# EAGLE design WaterThePlants168 (EAGLE 7.2.0)
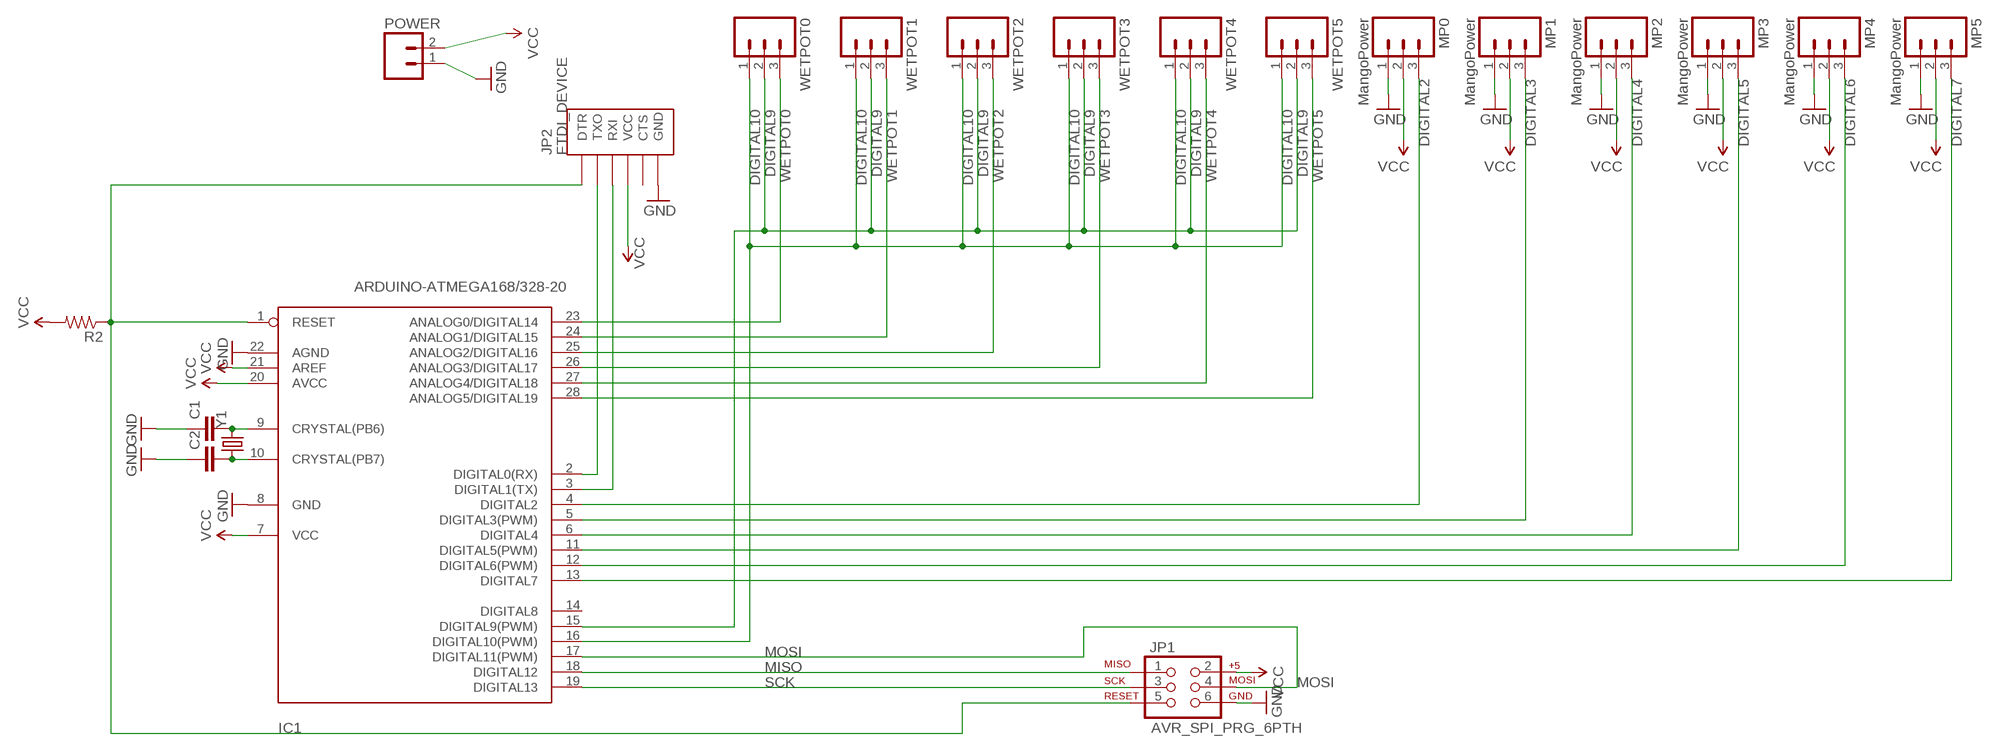
[diagram p0: schematic, sheet 1]

## Parts
C1  CAPPTH2  [CAP-PTH-SMALL2]
C2  CAPPTH2  [CAP-PTH-SMALL2]
IC1  ARDUINO-ATMEGA168/328-20  [DIL28-3]
JP1  AVR_SPI_PRG_6PTH  [2X3]
JP2  FTDI_DEVICE  [FTDI_DEVICE_SIDE]
MP0  MangoPower  M03PTH  [1X03]
MP1  MangoPower  M03PTH  [1X03]
MP2  MangoPower  M03PTH  [1X03]
MP3  MangoPower  M03PTH  [1X03]
MP4  MangoPower  M03PTH  [1X03]
MP5  MangoPower  M03PTH  [1X03]
POWER  M02POLAR  [MOLEX-1X2]
R2  RESISTORAXIAL-0.3  [AXIAL-0.3]
WETPOT0  M03PTH  [1X03]
WETPOT1  M03PTH  [1X03]
WETPOT2  M03PTH  [1X03]
WETPOT3  M03PTH  [1X03]
WETPOT4  M03PTH  [1X03]
WETPOT5  M03PTH  [1X03]
Y1  CRYSTALHC49US  [HC49US]

## Nets
DIGITAL2: IC1.4(DIGITAL2) MP0.3
DIGITAL3: IC1.5(DIGITAL3(PWM)) MP1.3
DIGITAL4: IC1.6(DIGITAL4) MP2.3
DIGITAL5: IC1.11(DIGITAL5(PWM)) MP3.3
DIGITAL6: IC1.12(DIGITAL6(PWM)) MP4.3
DIGITAL7: IC1.13(DIGITAL7) MP5.3
DIGITAL9: IC1.15(DIGITAL9(PWM)) WETPOT0.2 WETPOT1.2 WETPOT2.2 WETPOT3.2 WETPOT4.2 WETPOT5.2
DIGITAL10: IC1.16(DIGITAL10(PWM)) WETPOT0.1 WETPOT1.1 WETPOT2.1 WETPOT3.1 WETPOT4.1 WETPOT5.1
GND: C1.1 C2.1 IC1.8(GND) IC1.22(AGND) JP1.6 JP2.P$6(GND) MP0.1 MP1.1 MP2.1 MP3.1 MP4.1 MP5.1 POWER.1
MISO: IC1.18(DIGITAL12) JP1.1
MOSI: IC1.17(DIGITAL11(PWM)) JP1.4
N$1: IC1.2(DIGITAL0(RX)) JP2.P$2(TXO)
N$2: IC1.3(DIGITAL1(TX)) JP2.P$3(RXI)
N$3: C1.2 IC1.9(CRYSTAL(PB6)) Y1.2
N$4: C2.2 IC1.10(CRYSTAL(PB7)) Y1.1
RESET: IC1.1(RESET) JP1.5 JP2.P$1(DTR) R2.P$1
SCK: IC1.19(DIGITAL13) JP1.3
VCC: IC1.7(VCC) IC1.20(AVCC) IC1.21(AREF) JP1.2 JP2.P$4(VCC) MP0.2 MP1.2 MP2.2 MP3.2 MP4.2 MP5.2 POWER.2 R2.P$2
WETPOT0: IC1.23(ANALOG0/DIGITAL14) WETPOT0.3
WETPOT1: IC1.24(ANALOG1/DIGITAL15) WETPOT1.3
WETPOT2: IC1.25(ANALOG2/DIGITAL16) WETPOT2.3
WETPOT3: IC1.26(ANALOG3/DIGITAL17) WETPOT3.3
WETPOT4: IC1.27(ANALOG4/DIGITAL18) WETPOT4.3
WETPOT5: IC1.28(ANALOG5/DIGITAL19) WETPOT5.3
Unconnected: IC1.14(DIGITAL8) JP2.P$5(CTS)

## Library data of the parts
C1 C2 = SparkFun-Capacitors:CAP: Capacitor Standard 0603 ceramic capacitor, and 0.1" leaded capacitor.
IC1 = Parnell-CustomParts:ARDUINO-ATMEGA168/328: ATMEGA168/328 with Arduino Pin Mapping
JP1 = SparkFun-Connectors:AVR_SPI_PRG_6: AVR ISP 6 Pin This is the reduced ISP connector for AVR programming. Common on Arduino. This footprint will take up less PCB space and can be used with a 10-pin to 6-pin adapter such as SKU: BOB-08508 **Special note about "TEST_POINT" package. The stop mask is on the top side, so if you want your programming test points to be on the bottom of your board, make sure to place this package on the bottom side of the board. This also ensure that the orientation to program from the bottom side will be correct.
JP2 = SparkFun-Connectors:FTDI_DEVICE: Connector which mates to FTDI basic or FTDI cable.
MP0 MP1-MP5 WETPOT0 WETPOT1-WETPOT5 = SparkFun-Connectors:M03: Header 3 Standard 3-pin 0.1" header. Use with straight break away headers (SKU : PRT-00116), right angle break away headers (PRT-00553), swiss pins (PRT-00743), machine pins (PRT-00117), and female headers (PRT-00115). Molex polarized connector foot print use with SKU : PRT-08232 with associated crimp pins and housings.
POWER = SparkFun-Connectors:M02: Standard 2-pin 0.1" header. Use with - straight break away headers ( PRT-00116) - right angle break away headers (PRT-00553) - swiss pins (PRT-00743) - machine pins (PRT-00117) - female headers (PRT-00115) Molex polarized connector foot print use with: PRT-08233 with associated crimp pins and housings. 2.54_SCREWTERM for use with PRT-10571. 3.5mm Screw Terminal footprints for PRT-08084 5mm Screw Terminal footprints for use with PRT-08432
R2 = SparkFun-Resistors:RESISTOR: Resistor Basic schematic elements and footprints for 0603, 1206, and PTH resistors.
Y1 = SparkFun-FreqCtrl:CRYSTAL: Various standard crystals. Proven footprints.

## Board
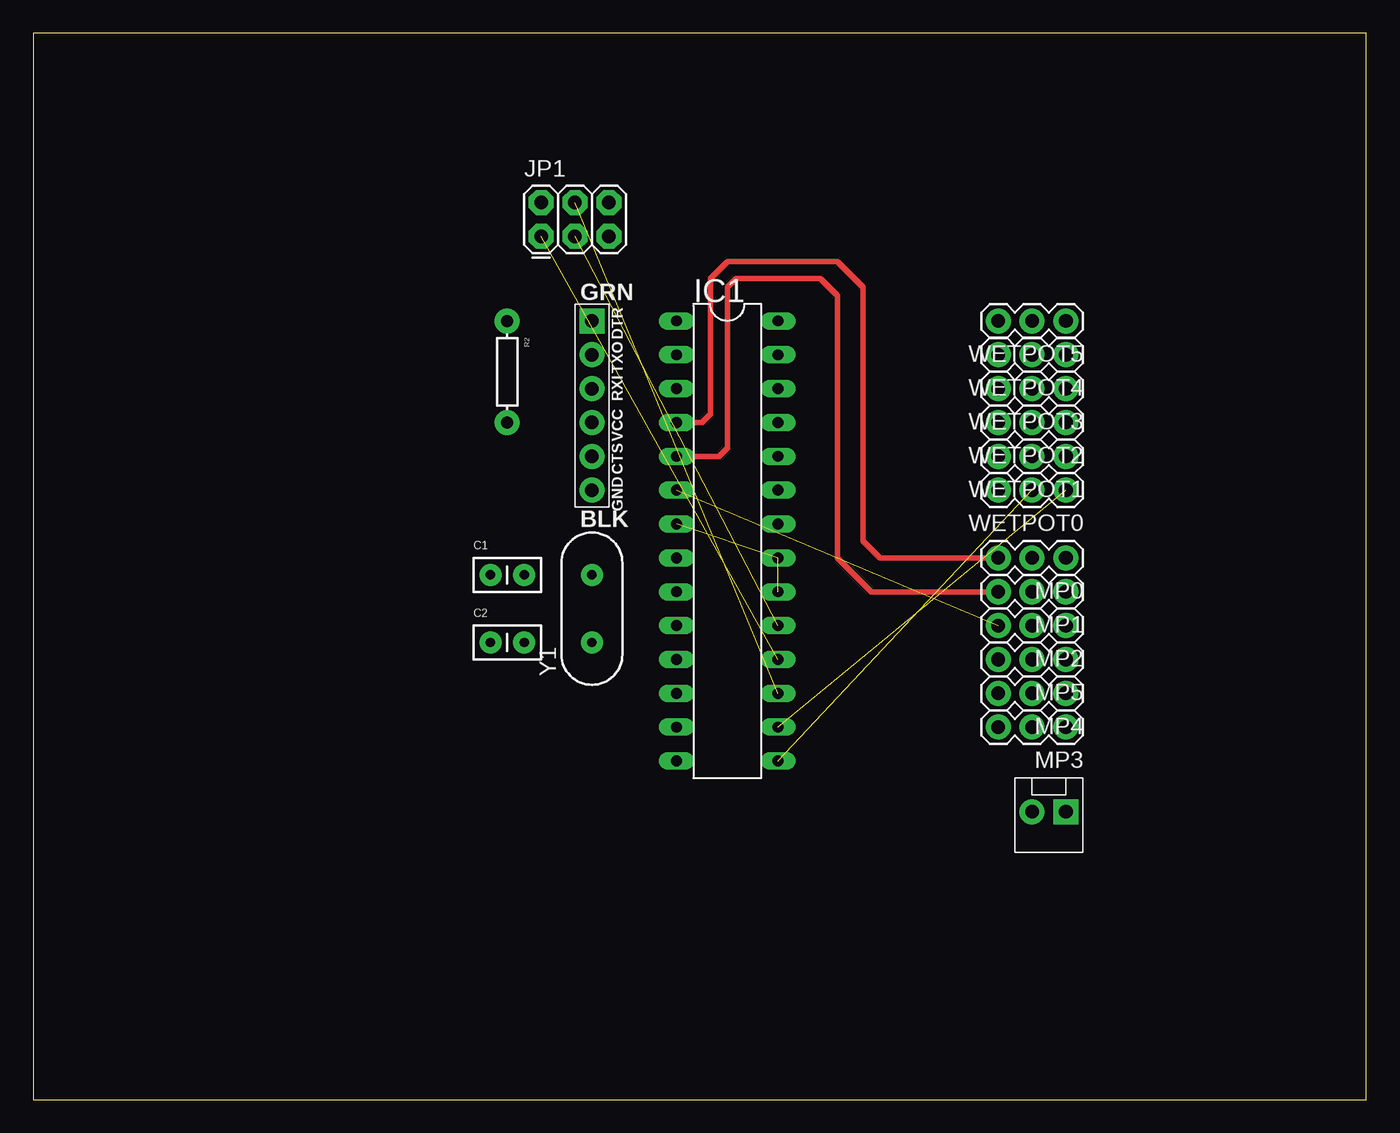
[diagram p1: board, top side]
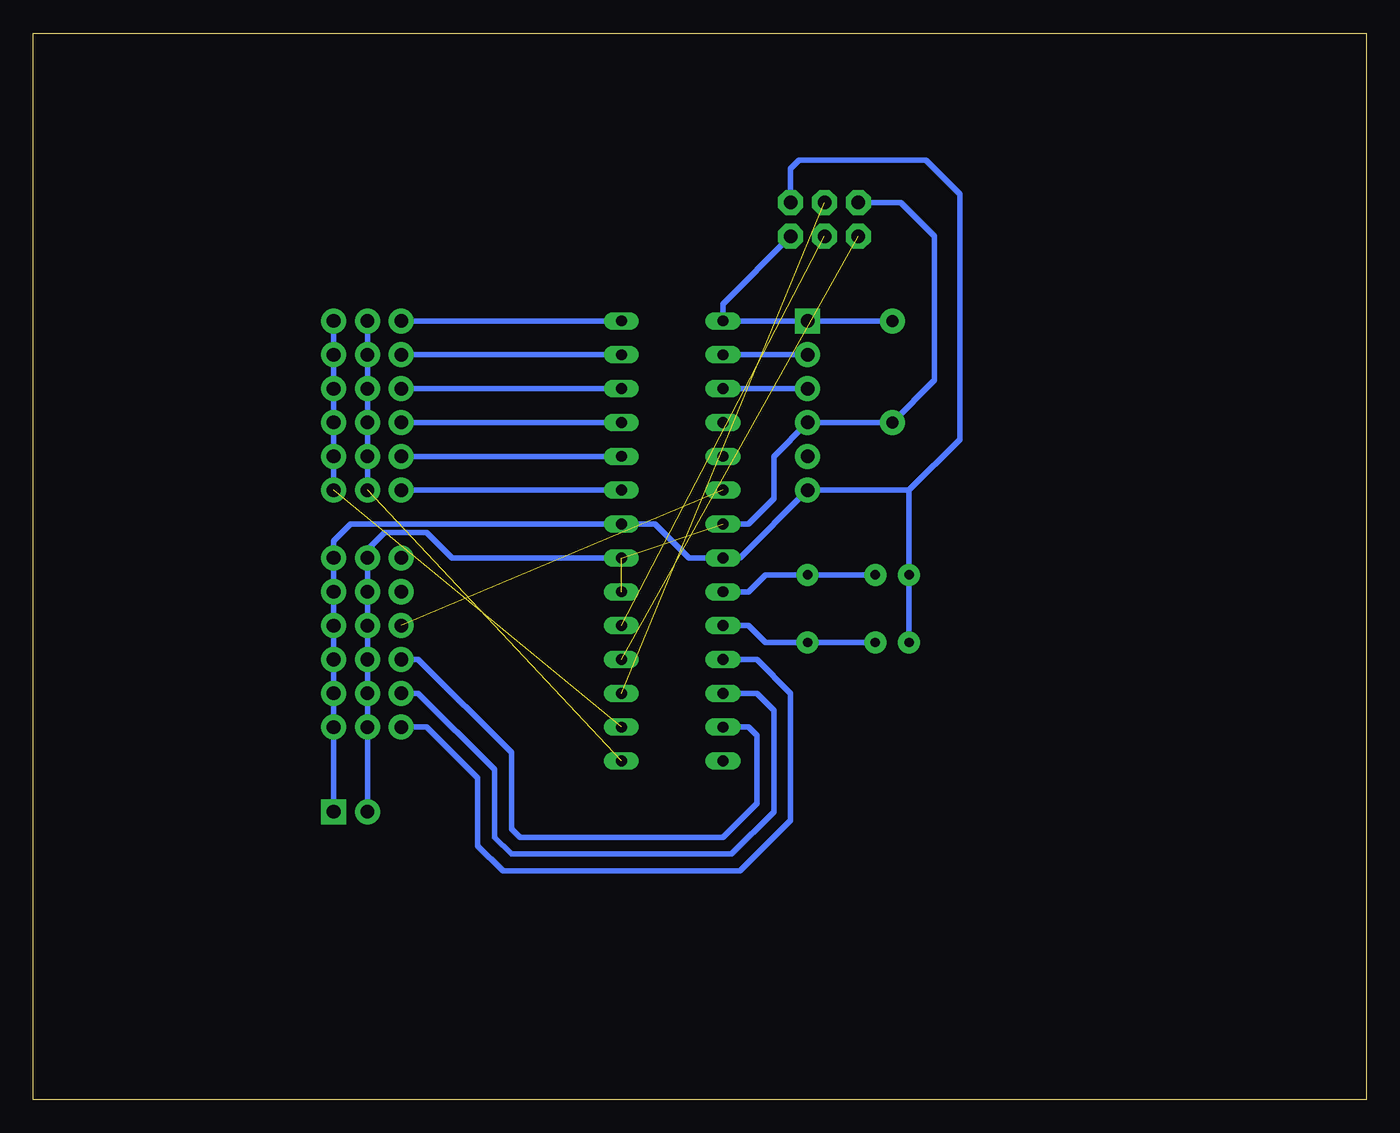
[diagram p2: board, bottom side, seen from below]

Size 100 x 80 mm. Coordinates in mm from the lower left corner, seen from the top.
Outline: 0,0 100,0 100,80 0,80 0,0
Copper layers (1*16): Top 0.035mm / dielectric 1.5mm / Bottom 0.035mm
Design rules "default": minimum track width 10mil, minimum drill 24mil, track to track 8mil, track to pad 8mil, pad to pad 8mil, via to via 8mil, smd to smd 8mil, copper to edge 40mil, drill to drill 8mil, minimum pad ring 10mil, minimum via ring 8mil, stop-mask expansion 4mil, vias tented up to drill 0mil, thermal gap 10mil

### Footprints (pad centres in the part's own frame; a part is rotated, then mirrored left to right if it is on the bottom)
CAP-PTH-SMALL2 = drill 0.7 pad 1.651: 1 0,0; 2 2.54,0
DIL28-3 = drill 0.813 long: 1 -16.51,-3.81; 2 -13.97,-3.81; 3 -11.43,-3.81; 4 -8.89,-3.81; 5 -6.35,-3.81; 6 -3.81,-3.81; 7 -1.27,-3.81; 8 1.27,-3.81; 9 3.81,-3.81; 10 6.35,-3.81; 11 8.89,-3.81; 12 11.43,-3.81; 13 13.97,-3.81; 14 16.51,-3.81; 15 16.51,3.81; 16 13.97,3.81; 17 11.43,3.81; 18 8.89,3.81; 19 6.35,3.81; 20 3.81,3.81; 21 1.27,3.81; 22 -1.27,3.81; 23 -3.81,3.81; 24 -6.35,3.81; 25 -8.89,3.81; 26 -11.43,3.81; 27 -13.97,3.81; 28 -16.51,3.81
2X3 = drill 1.016 pad 1.88 octagon: 1 0,0; 2 0,2.54; 3 2.54,0; 4 2.54,2.54; 5 5.08,0; 6 5.08,2.54
FTDI_DEVICE_SIDE = drill 1.016 pad 1.88 square: P$1 -6.35,0 | drill 1.016 pad 1.88: P$2 -3.81,0; P$3 -1.27,0; P$4 1.27,0; P$5 3.81,0; P$6 6.35,0
1X03 = drill 1.016 pad 1.88: 1 0,0; 2 2.54,0; 3 5.08,0
MOLEX-1X2 = drill 1.016 pad 1.88 square: 1 0,0 | drill 1.016 pad 1.88: 2 2.54,0
AXIAL-0.3 = drill 0.9 pad 1.88: P$1 -3.81,0; P$2 3.81,0
HC49US = drill 0.7 pad 1.651: 1 -2.54,0; 2 2.54,0

### Placement (x,y rotation side)
C1  34.29,39.37 0 top
C2  34.29,34.29 0 top
IC1  52.07,41.91 270 top
JP1  38.1,64.77 0 top
JP2  41.91,52.07 270 top
MP0  77.47,40.64 180 top
MP1  77.47,38.1 180 top
MP2  77.47,35.56 180 top
MP3  77.47,27.94 180 top
MP4  77.47,30.48 180 top
MP5  77.47,33.02 180 top
POWER  77.47,21.59 180 top
R2  35.56,54.61 270 top
WETPOT0  77.47,45.72 180 top
WETPOT1  77.47,48.26 180 top
WETPOT2  77.47,50.8 180 top
WETPOT3  77.47,53.34 180 top
WETPOT4  77.47,55.88 180 top
WETPOT5  77.47,58.42 180 top
Y1  41.91,36.83 90 top

### Tracks (layer width: path | path; a pad name or v marks a point on that pad's centre or on a via)
DIGITAL2
  Top 0.406: IC1.4 50.16,50.8 50.8,51.44 50.8,61.59 52.07,62.87 60.33,62.87 62.23,60.96 62.23,41.91 63.5,40.64 MP0.3
DIGITAL3
  Top 0.406: MP1.3 62.87,38.1 60.33,40.64 60.33,60.33 59.05,61.59 52.7,61.59 52.07,60.96 52.07,48.9 51.44,48.26 IC1.5
DIGITAL4  (1 unrouted)
DIGITAL5
  Bottom 0.406: IC1.11 45.72,33.02 43.18,30.48 43.18,20.95 46.99,17.14 64.77,17.14 66.67,19.05 66.67,24.13 70.48,27.94 MP3.3
DIGITAL6
  Bottom 0.406: IC1.12 45.72,30.48 44.45,29.21 44.45,21.59 47.62,18.41 64.14,18.41 65.41,19.68 65.41,24.77 71.12,30.48 MP4.3
DIGITAL7
  Bottom 0.406: MP5.3 71.12,33.02 64.14,26.04 64.14,20.32 63.5,19.68 48.26,19.68 45.72,22.23 45.72,27.3 46.35,27.94 IC1.13
DIGITAL9  (1 unrouted)
  Bottom 0.406: WETPOT5.2 WETPOT4.2 WETPOT3.2 WETPOT2.2 WETPOT1.2 WETPOT0.2
DIGITAL10  (1 unrouted)
  Bottom 0.406: WETPOT0.1 WETPOT1.1 WETPOT2.1 WETPOT3.1 WETPOT4.1 WETPOT5.1
GND
  Bottom 0.406: POWER.1 MP3.1 MP4.1 MP5.1 MP2.1 MP1.1 MP0.1 77.47,41.91 76.2,43.18 IC1.22 53.34,43.18 50.8,40.64 IC1.8 46.99,40.64 JP2.P$6 | JP2.P$6 41.27,45.72 | 34.29,45.72 C1.1 C2.1 | JP2.P$6 41.91,46.35 41.27,45.72 | 41.27,45.72 34.29,45.72 | 34.29,45.72 30.48,49.53 30.48,67.94 33.02,70.48 42.55,70.48 43.18,69.85 JP1.6
MISO  (1 unrouted)
MOSI  (1 unrouted)
N$1
  Bottom 0.406: JP2.P$2 IC1.2
N$2
  Bottom 0.406: IC1.3 JP2.P$3
N$3
  Bottom 0.406: IC1.9 46.35,38.1 45.09,39.37 Y1.2 C1.2
N$4
  Bottom 0.406: IC1.10 46.35,35.56 45.09,34.29 Y1.1 C2.2
RESET
  Bottom 0.406: R2.P$1 JP2.P$1 IC1.1 48.26,59.69 JP1.5
SCK  (1 unrouted)
VCC  (2 unrouted)
  Bottom 0.406: POWER.2 MP3.2 MP4.2 MP5.2 MP2.2 MP1.2 MP0.2 74.93,41.27 73.66,42.55 70.48,42.55 68.58,40.64 IC1.21 | IC1.7 46.35,43.18 44.45,45.09 44.45,48.26 JP2.P$4 R2.P$2 32.38,53.98 32.38,64.77 34.92,67.31 JP1.2
WETPOT0
  Bottom 0.406: WETPOT0.3 IC1.23
WETPOT1
  Bottom 0.406: IC1.24 WETPOT1.3
WETPOT2
  Bottom 0.406: WETPOT2.3 IC1.25
WETPOT3
  Bottom 0.406: IC1.26 WETPOT3.3
WETPOT4
  Bottom 0.406: IC1.27 WETPOT4.3
WETPOT5
  Bottom 0.406: WETPOT5.3 IC1.28